# Altium schematic sheet Controller_Part.SchDoc
size A3
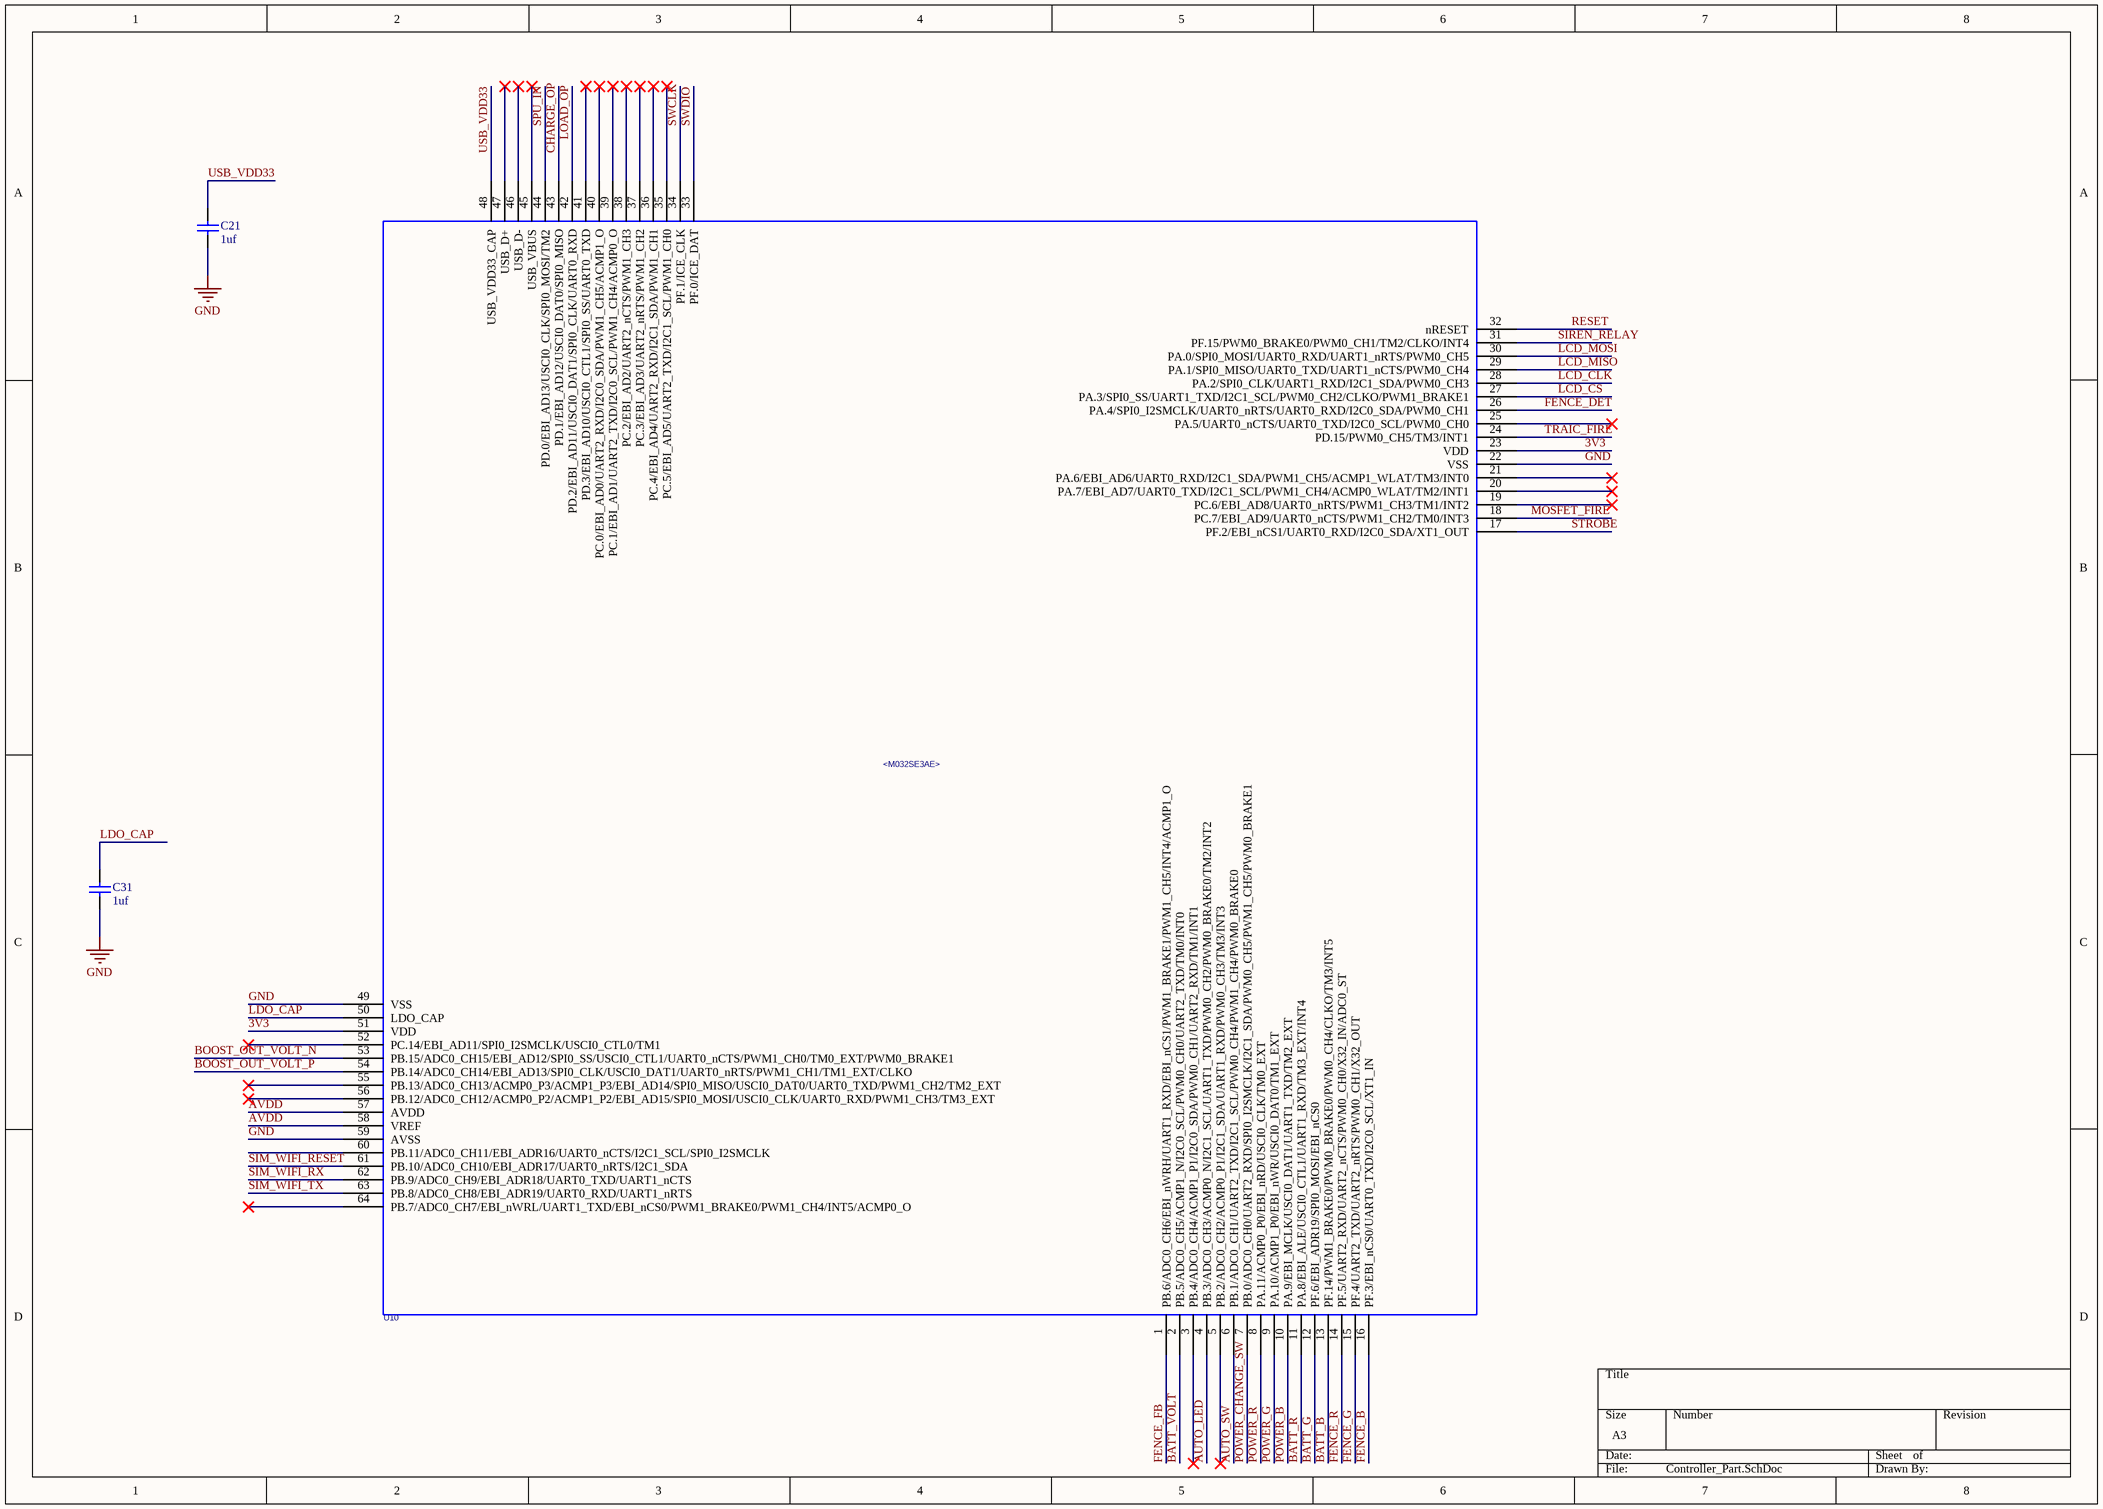
[diagram p0: Controller_Part.SchDoc]

## Parts
C21  value 1uf  [0805]  (hidden comment: Cap)
C31  value 1uf  [0805]  (hidden comment: Cap)
U10  M031SE3AE: <M032SE3AE>  [LQFP-64]  (hidden comment: M031SE3AE)

## Nets
GND: C21.1 C31.1 U10.22(VSS) U10.49(VSS) U10.59(AVSS)
3V3: U10.23(VDD) U10.51(VDD)
AUTO_LED: U10.4(PB.3/ADC0_CH3/ACMP0_N/I2C1_SCL/UART1_TXD/PWM0_CH2/PWM0_BRAKE0/TM2/INT2)
AUTO_SW: U10.6(PB.1/ADC0_CH1/UART2_TXD/I2C1_SCL/PWM0_CH4/PWM1_CH4/PWM0_BRAKE0)
AVDD: U10.57(AVDD) U10.58(VREF)
BATT_B: U10.13(PF.14/PWM1_BRAKE0/PWM0_BRAKE0/PWM0_CH4/CLKO/TM3/INT5)
BATT_G: U10.12(PF.6/EBI_ADR19/SPI0_MOSI/EBI_nCS0)
BATT_R: U10.11(PA.8/EBI_ALE/USCI0_CTL1/UART1_RXD/TM3_EXT/INT4)
BATT_VOLT: U10.2(PB.5/ADC0_CH5/ACMP1_N/I2C0_SCL/PWM0_CH0/UART2_TXD/TM0/INT0)
BOOST_OUT_VOLT_N: U10.53(PB.15/ADC0_CH15/EBI_AD12/SPI0_SS/USCI0_CTL1/UART0_nCTS/PWM1_CH0/TM0_EXT/PWM0_BRAKE1)
BOOST_OUT_VOLT_P: U10.54(PB.14/ADC0_CH14/EBI_AD13/SPI0_CLK/USCI0_DAT1/UART0_nRTS/PWM1_CH1/TM1_EXT/CLKO)
CHARGE_OP: U10.43(PD.1/EBI_AD12/USCI0_DAT0/SPI0_MISO)
FENCE_B: U10.16(PF.3/EBI_nCS0/UART0_TXD/I2C0_SCL/XT1_IN)
FENCE_DET: U10.26(PA.4/SPI0_I2SMCLK/UART0_nRTS/UART0_RXD/I2C0_SDA/PWM0_CH1)
FENCE_FB: U10.1(PB.6/ADC0_CH6/EBI_nWRH/UART1_RXD/EBI_nCS1/PWM1_BRAKE1/PWM1_CH5/INT4/ACMP1_O)
FENCE_G: U10.15(PF.4/UART2_TXD/UART2_nRTS/PWM0_CH1/X32_OUT)
FENCE_R: U10.14(PF.5/UART2_RXD/UART2_nCTS/PWM0_CH0/X32_IN/ADC0_ST)
LCD_CLK: U10.28(PA.2/SPI0_CLK/UART1_RXD/I2C1_SDA/PWM0_CH3)
LCD_CS: U10.27(PA.3/SPI0_SS/UART1_TXD/I2C1_SCL/PWM0_CH2/CLKO/PWM1_BRAKE1)
LCD_MISO: U10.29(PA.1/SPI0_MISO/UART0_TXD/UART1_nCTS/PWM0_CH4)
LCD_MOSI: U10.30(PA.0/SPI0_MOSI/UART0_RXD/UART1_nRTS/PWM0_CH5)
LDO_CAP: C31.2 U10.50(LDO_CAP)
LOAD_OP: U10.42(PD.2/EBI_AD11/USCI0_DAT1/SPI0_CLK/UART0_RXD)
MOSFET_FIRE: U10.18(PC.7/EBI_AD9/UART0_nCTS/PWM1_CH2/TM0/INT3)
POWER_B: U10.10(PA.9/EBI_MCLK/USCI0_DAT1/UART1_TXD/TM2_EXT)
POWER_CHANGE_SW: U10.7(PB.0/ADC0_CH0/UART2_RXD/SPI0_I2SMCLK/I2C1_SDA/PWM0_CH5/PWM1_CH5/PWM0_BRAKE1)
POWER_G: U10.9(PA.10/ACMP1_P0/EBI_nWR/USCI0_DAT0/TM1_EXT)
POWER_R: U10.8(PA.11/ACMP0_P0/EBI_nRD/USCI0_CLK/TM0_EXT)
RESET: U10.32(nRESET)
SIM_WIFI_RESET: U10.61(PB.10/ADC0_CH10/EBI_ADR17/UART0_nRTS/I2C1_SDA)
SIM_WIFI_RX: U10.62(PB.9/ADC0_CH9/EBI_ADR18/UART0_TXD/UART1_nCTS)
SIM_WIFI_TX: U10.63(PB.8/ADC0_CH8/EBI_ADR19/UART0_RXD/UART1_nRTS)
SIREN_RELAY: U10.31(PF.15/PWM0_BRAKE0/PWM0_CH1/TM2/CLKO/INT4)
SPU_IN: U10.44(PD.0/EBI_AD13/USCI0_CLK/SPI0_MOSI/TM2)
STROBE: U10.17(PF.2/EBI_nCS1/UART0_RXD/I2C0_SDA/XT1_OUT)
SWCLK: U10.34(PF.1/ICE_CLK)
SWDIO: U10.33(PF.0/ICE_DAT)
TRAIC_FIRE: U10.24(PD.15/PWM0_CH5/TM3/INT1)
USB_VDD33: C21.2 U10.48(USB_VDD33_CAP)

Not connected (* = marked no-connect by the designer): U10 3(PB.4/ADC0_CH4/ACMP1_P1/I2C0_SDA/PWM0_CH1/UART2_RXD/TM1/INT1)* 5(PB.2/ADC0_CH2/ACMP0_P1/I2C1_SDA/UART1_RXD/PWM0_CH3/TM3/INT3)* 19(PC.6/EBI_AD8/UART0_nRTS/PWM1_CH3/TM1/INT2)* 20(PA.7/EBI_AD7/UART0_TXD/I2C1_SCL/PWM1_CH4/ACMP0_WLAT/TM2/INT1)* 21(PA.6/EBI_AD6/UART0_RXD/I2C1_SDA/PWM1_CH5/ACMP1_WLAT/TM3/INT0)* 25(PA.5/UART0_nCTS/UART0_TXD/I2C0_SCL/PWM0_CH0)* 35(PC.5/EBI_AD5/UART2_TXD/I2C1_SCL/PWM1_CH0)* 36(PC.4/EBI_AD4/UART2_RXD/I2C1_SDA/PWM1_CH1)* 37(PC.3/EBI_AD3/UART2_nRTS/PWM1_CH2)* 38(PC.2/EBI_AD2/UART2_nCTS/PWM1_CH3)* 39(PC.1/EBI_AD1/UART2_TXD/I2C0_SCL/PWM1_CH4/ACMP0_O)* 40(PC.0/EBI_AD0/UART2_RXD/I2C0_SDA/PWM1_CH5/ACMP1_O)* 41(PD.3/EBI_AD10/USCI0_CTL1/SPI0_SS/UART0_TXD)* 45(USB_VBUS)* 46(USB_D-)* 47(USB_D+)* 52(PC.14/EBI_AD11/SPI0_I2SMCLK/USCI0_CTL0/TM1)* 55(PB.13/ADC0_CH13/ACMP0_P3/ACMP1_P3/EBI_AD14/SPI0_MISO/USCI0_DAT0/UART0_TXD/PWM1_CH2/TM2_EXT)* 56(PB.12/ADC0_CH12/ACMP0_P2/ACMP1_P2/EBI_AD15/SPI0_MOSI/USCI0_CLK/UART0_RXD/PWM1_CH3/TM3_EXT)* 60(PB.11/ADC0_CH11/EBI_ADR16/UART0_nCTS/I2C1_SCL/SPI0_I2SMCLK) 64(PB.7/ADC0_CH7/EBI_nWRL/UART1_TXD/EBI_nCS0/PWM1_BRAKE0/PWM1_CH4/INT5/ACMP0_O)*

## Library data of the parts
C21 C31 = Cap: Capacitor; Published: 8-Jun-2000; LatestRevisionDate: 17-Jul-2002; LatestRevisionNote: Re-released for DXP Platform.; PackageReference: RAD-0.3; Publisher: Altium Limited; PackageDescription: Radial Cap, Thru-Hole; 2 Leads; 0.3 in Pin Spacing
U10 = M031SE3AE: OriginalSymbolOrigin: (0,0)